# EAGLE design AST1045 (EAGLE 6.3)
DATABASE: ./../../../../../Components/TinyCircuits_Part_Database.txt
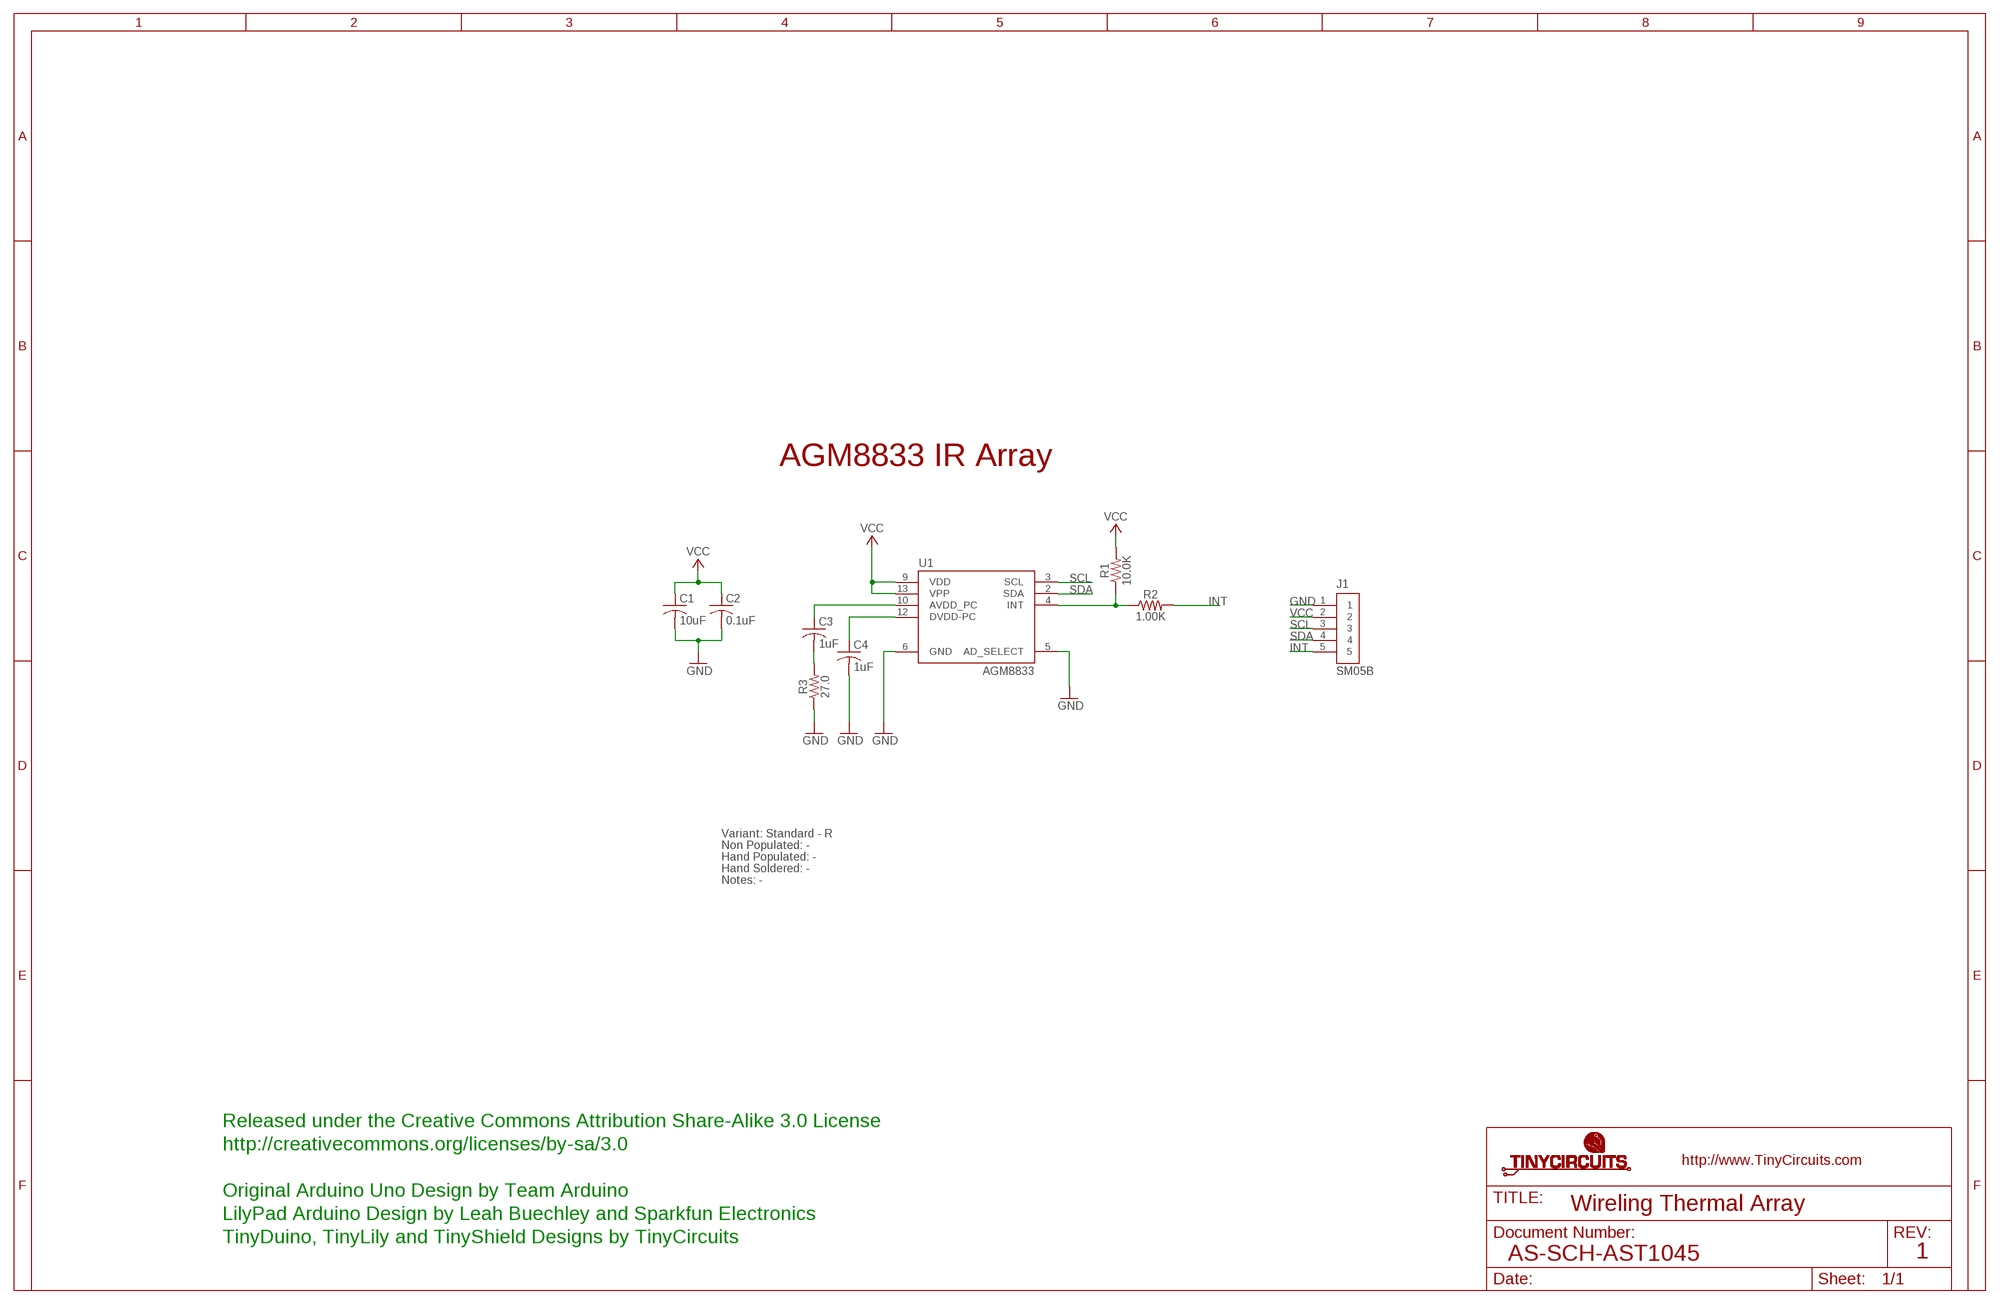
[diagram p0: schematic, sheet 1]

## Parts
C1  10uF  AS-ITM-00002  [C0603]
C2  0.1uF  AS-ITM-00008  [C0402]
C3  1uF  AS-ITM-00105  [C0402]
C4  1uF  AS-ITM-00105  [C0402]
J1  SM05B  AS-ITM-00340  [JST_SH_5X1]
R1  10.0K  AS-ITM-00032  [0402]
R2  1.00K  AS-ITM-00003  [0402]
R3  27.0  AS-ITM-00240  [0402]
U1  AGM8833  AS-ITM-00545  [AMG8833]

## Nets
GND: C1.2 C2.2 C4.2 J1.1 R3.1 U1.5(AD_SELECT) U1.6(GND)
INT: J1.5 R2.2
N$1: C3.1 U1.10(AVDD_PC)
N$2: C3.2 R3.2
N$4: C4.1 U1.12(DVDD-PC)
N$9: R1.1 R2.1 U1.4(INT)
SCL: J1.3 U1.3(SCL)
SDA: J1.4 U1.2(SDA)
VCC: C1.1 C2.1 J1.2 R1.2 U1.9(VDD) U1.13(VPP)

## Notes on the sheet
- AGM8833 IR Array
- Variant: Standard - R
- Non Populated: -
- Hand Populated: -
- Hand Soldered: -
- Notes: -
- Released under the Creative Commons Attribution Share-Alike 3.0 License
- http://creativecommons.org/licenses/by-sa/3.0
- Original Arduino Uno Design by Team Arduino
- Wireling Thermal Array
- LilyPad Arduino Design by Leah Buechley and Sparkfun Electronics
- TinyDuino, TinyLily and TinyShield Designs by TinyCircuits
- AS-SCH-AST1045 | 1

## Library data of the parts
C1 = tinycircuits:AS-ITM-00002: CAP CER 10UF 10V 20% X5R 0603; PARTNO: AS-ITM-00002
C2 = tinycircuits:AS-ITM-00008: CAP CER 0.1UF 16V 10% X5R 0402; PARTNO: AS-ITM-00008
C3 C4 = tinycircuits:AS-ITM-00105: CAP CER 1UF 6.3V 10% X5R 0402; PARTNO: AS-ITM-00105
J1 = tinycircuits:AS-ITM-00340: CONN HEADER SH 5POS SIDE 1MM TIN; PARTNO: AS-ITM-00340; PNPROTATION: 180
R1 = tinycircuits:AS-ITM-00032: RES 10.0K OHM 1/16W 1% 0402 SMD; PARTNO: AS-ITM-00032
R2 = tinycircuits:AS-ITM-00003: RES 1.00K OHM 1/16W 1% 0402; PARTNO: AS-ITM-00003
R3 = tinycircuits:AS-ITM-00240: RES 27 OHM 1/16W 5% 0402 SMD; PARTNO: AS-ITM-00240
U1 = tinycircuits:AS-ITM-00545: SENSOR DGTL THERMOPILE 14SMD MODULE; PARTNO: AS-ITM-00545

## Net classes
2 gnd: width 0.305 mm, drill 0.559 mm, clearance 0.254 mm

## Board
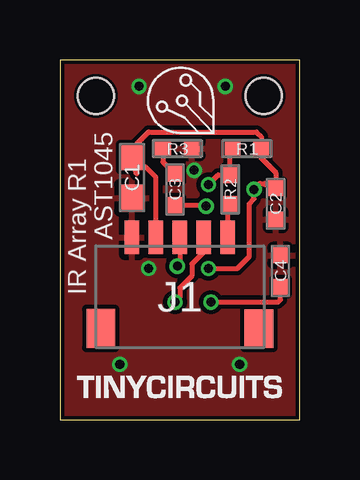
[diagram p1: board, top side]
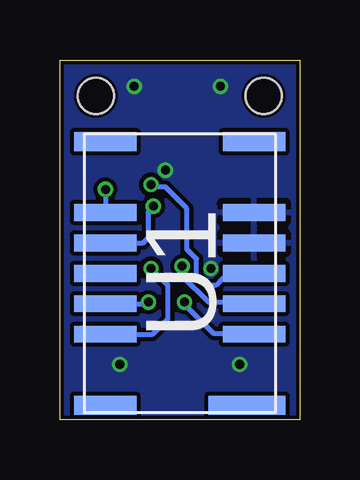
[diagram p2: board, bottom side, seen from below]

Size 10 x 15 mm. Coordinates in mm from the lower left corner, seen from the top.
Outline: 0,0 10,0 10,15 0,15 0,0
Copper layers (1*16): Top 0.035mm / dielectric 1.5mm / Bottom 0.035mm
Design rules "default *": minimum track width 8mil, minimum drill 15mil, track to track 7mil, track to pad 7mil, pad to pad 7mil, via to via 7mil, smd to smd 7mil, copper to edge 6mil, drill to drill 8mil, minimum pad ring 8mil, minimum via ring 5mil, stop-mask expansion 4mil, vias tented up to drill 25mil, thermal gap 10mil
Holes 1.5 mm at 1.5,13.5 8.5,13.5

### Footprints (pad centres in the part's own frame; a part is rotated, then mirrored left to right if it is on the bottom)
C0603 = smd 1.1 x 1: 1 -0.85,0; 2 0.85,0
C0402 = smd 0.65 x 0.6: 1 -0.65,0; 2 0.65,0
JST_SH_5X1 = smd 0.6 x 1.4: 1 -2,2.475; 2 -1,2.475; 3 0,2.475; 4 1,2.475; 5 2,2.475 | smd 1.2 x 1.6: PAD1 -3.3,-1.325; PAD2 3.3,-1.325
0402 = smd 0.65 x 0.55: 1 -0.6,0; 2 0.6,0
AMG8833 = smd 0.8 x 3.2: 1 -5.5,-2.8 | smd 0.7 x 2.6: 2 -2.54,-3.1; 3 -1.27,-3.1; 4 0,-3.1; 5 1.27,-3.1; 6 2.54,-3.1; 9 2.54,3.1; 10 1.27,3.1; 11 0,3.1; 12 -1.27,3.1; 13 -2.54,3.1 | smd 0.8 x 2.6: 7 5.5,-3.1; 8 5.5,3.1; 14 -5.5,3.1

### Placement (x,y rotation side)
C1  3,10.1 270 top
C2  9,9 270 top
C3  4.8,9.6 90 top
C4  9.2,6.2 90 top
J1  5,5.12 0 top
R1  7.8,11.3 0 top
R2  7.1,9.6 270 top
R3  4.9,11.3 180 top
U1  5,6.1 90 bottom
U$1  [DOCFIELD-TINYCIRCUITS-PCB]  19,-5 0 top  (outside the outline)

### Tracks (layer width: path | path; a pad name or v marks a point on that pad's centre or on a via)
GND  (via drill 0.38)
  other vias: 6.9,13.9 3.7,6.3 3.3,13.9 5.6,10.4 2.5,2.3 7.5,2.3
  pour Bottom: 0,15 10,15 10,0 0,0
  pour Top: 0,15 10,15 10,0 0,0
INT
  Top 0.203: J1.5 7,8.9 R2.2
N$1  (via drill 0.38)
  Top 0.203: C3.1 6.05,8.95 v6.1,8.9
  Bottom 0.203: U1.10 6.53,7.37 6.3,7.6 6.3,8.7 v6.1,8.9
N$2
  Top 0.203: R3.2 4.3,10.75 C3.2
N$4  (via drill 0.38)
  Top 0.203: v6.3,4.9 9.1,4.9 9.2,5 C4.1
  Bottom 0.203: U1.12 6.37,4.83 v6.3,4.9
N$9  (via drill 0.38)
  Top 0.203: v6.2,9.8 6.6,10.2 R2.1 7.1,11.2 R1.1
  Bottom 0.203: U1.4 2.9,6.1 3.1,5.9 3.2,5.9 3.5,5.6 3.9,5.6 4.3,6 4.3,6.7 4.7,7.1 4.7,8.8 5.6,9.7 6.1,9.7 v6.2,9.8
SCL  (via drill 0.38)
  Top 0.203: J1.3 5,6.5 v4.9,6.4
  Bottom 0.203: v4.9,6.4 4.9,6 3.8,4.9 1.97,4.9 U1.3
SDA  (via drill 0.38)
  Top 0.203: J1.4 6,7 5.5,6.5 5.5,6 5,5.5 5,5.1 v4.8,4.9
  Bottom 0.203: v4.8,4.9 4.8,4.8 3.6,3.6 1.94,3.6 U1.2
VCC  (via drill 0.38)
  Top 0.203: v6.2,6.3 7.4,6.3 7.9,6.8 7.9,9 8.1,9.2 v8.1,9.6 8.35,9.85 C2.1 | C2.1 8.55,9.85 | J1.2 4,10.1 3.1,11 3,10.85 C1.1 3.2,10.25 3.2,11.5 3.7,12 8.2,12 8.4,11.8 R1.2 8.4,10.9 9,10.3 C2.1
  Bottom 0.203: U1.13 6.14,3.56 5.5,4.2 5.5,5.6 v6.2,6.3 | v8.1,9.6 U1.9

### Text on the board
tPlace: AST1045 | IR Array R1
Document: FABRICATION DRAWING | NOTES: | 1. PRINTED CIRCUIT BOARD MADE FROM NEMA GRADE FR-4 EPOXY LAMINATE | WITH 1 OUNCE COPPER PLATING AND .024 THICKNESS. | 2. ALL DIMENSIONS ARE GIVEN IN MILLIMETERS. | 3. CIRCUIT PATHS ARE FOR REFERENCE ONLY. | 4. HOLE SIZES SHOWN ARE FINISHED DIAMETERS AFTER PLATING. | 5. BOARD PLATED USING REFLOW OR SIMILAR METHOD. | 6. BOARD TO HAVE BLUE SOLDER MASK ON PLATED SURFACES USING WET FILM | 7. SILKSCREEN BOARD USING WHITE INK. | SR100 OR SR1010 EPOXY. EQUIVALENT WET OR DRY FILM MAY BE USED. | 8. THE FOLLOWING INFORMATION APPLIES TO THIS BOARD: | * 2 COPPER LAYERS | * .024 BOARD THICKNESS | * REQUIRES TOP SIDE SILKSCREEN | Released under the Creative Commons Attribution Share-Alike 3.0 License | http://creativecommons.org/licenses/by-sa/3.0 | Original Arduino Uno Design by Team Arduino | LilyPad Arduino Design by Leah Buechley and Sparkfun Electronics | TinyDuino, TinyLily and TinyShield Designs by TinyCircuits | Wireling Thermal Array | AS-PCB-AST1045 | 1